# EAGLE design untitled (EAGLE 9.5.1)
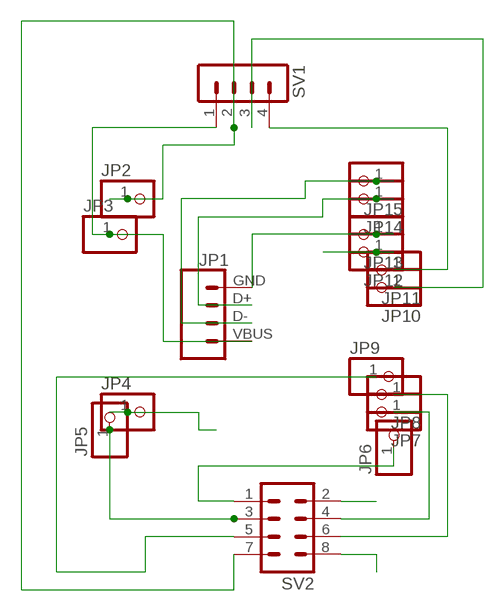
[diagram p0: schematic, sheet 1]

## Parts
JP1  USB_SOLDER_PADS  [USB-SOLDER-PADS]
JP2  PINHD-1X1  [1X01]
JP3  PINHD-1X1  [1X01]
JP4  PINHD-1X1  [1X01]
JP5  PINHD-1X1  [1X01]
JP6  PINHD-1X1  [1X01]
JP7  PINHD-1X1  [1X01]
JP8  PINHD-1X1  [1X01]
JP9  PINHD-1X1  [1X01]
JP10  PINHD-1X1  [1X01]
JP11  PINHD-1X1  [1X01]
JP12  PINHD-1X1  [1X01]
JP13  PINHD-1X1  [1X01]
JP14  PINHD-1X1  [1X01]
JP15  PINHD-1X1  [1X01]
SV1  MA04-1  [MA04-1]
SV2  MA04-2  [MA04-2]

## Nets
N$1: JP1.VBUS JP3.1 SV1.1
N$2: JP1.GND JP13.1
N$3: JP11.1 SV1.4
N$4: JP10.1 SV1.3
N$5: JP8.1 SV2.6
N$6: JP1.D+ JP14.1
N$7: JP1.D- JP15.1
N$8: JP12.1
N$9: JP5.1 SV2.3
N$10: JP6.1 SV2.1
N$11: JP4.1
N$12: JP7.1 SV2.4
N$13: SV2.8
N$14: SV2.2
N$16: JP2.1 SV1.2 SV2.7
N$18: JP9.1 SV2.5

## Library data of the parts
JP1 = SparkFun-Connectors:USB_SOLDER_PADS: Solder pad access to USB pins. Helpful to expose on PCBs so user can attach external USB connector if necessary.
JP2-JP15 = pinhead:PINHD-1X1: PIN HEADER
SV1 = con-lstb:MA04-1: PIN HEADER; OC_FARNELL: unknown; OC_NEWARK: unknown
SV2 = con-lstb:MA04-2: PIN HEADER; OC_FARNELL: unknown; OC_NEWARK: unknown

## Board
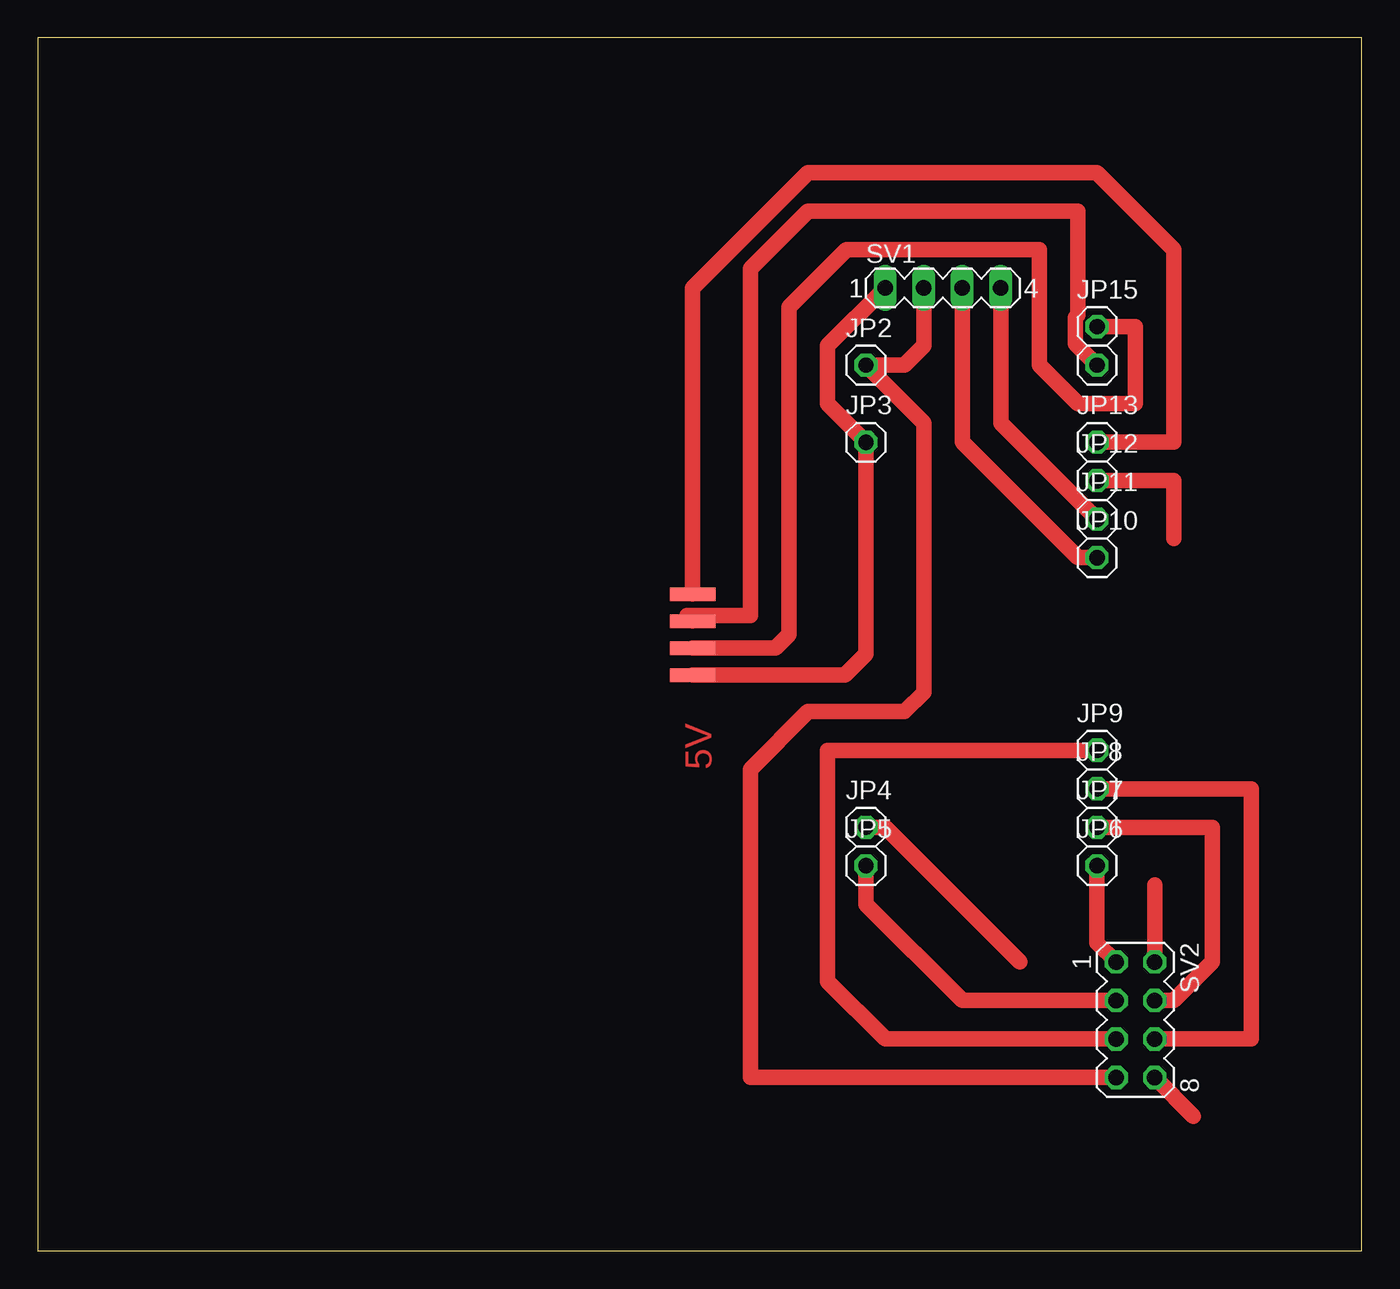
[diagram p1: board, top side]

Size 87.3 x 80 mm. Coordinates in mm from the lower left corner, seen from the top.
Outline: 0,0 87.3,0 87.3,80 0,80 0,0
Copper layers (1*16): Top 0.035mm / dielectric 1.5mm / Bottom 0.035mm
Design rules "default": minimum track width 10mil, minimum drill 0.35mm, track to track 10mil, track to pad 6mil, pad to pad 6mil, via to via 6mil, smd to smd 6mil, copper to edge 40mil, drill to drill 6mil, minimum pad ring 10mil, minimum via ring 8mil, stop-mask expansion 4mil, vias tented up to drill 0mil, thermal gap 10mil

### Footprints (pad centres in the part's own frame; a part is rotated, then mirrored left to right if it is on the bottom)
USB-SOLDER-PADS = smd 3 x 0.9: D+ 0,-0.889; D- 0,0.889; GND 0,-2.667; VBUS 0,2.667
1X01 = drill 1.016 octagon: 1 0,0
MA04-1 = drill 1.016 long: 1 -3.81,0; 2 -1.27,0; 3 1.27,0; 4 3.81,0
MA04-2 = drill 1.016 octagon: 1 -3.81,-1.27; 2 -3.81,1.27; 3 -1.27,-1.27; 4 -1.27,1.27; 5 1.27,-1.27; 6 1.27,1.27; 7 3.81,-1.27; 8 3.81,1.27

### Placement (x,y rotation side)
JP1  43.18,40.64 180 top
JP2  54.61,58.42 0 top
JP3  54.61,53.34 0 top
JP4  54.61,27.94 0 top
JP5  54.61,25.4 0 top
JP6  69.85,25.4 0 top
JP7  69.85,27.94 0 top
JP8  69.85,30.48 0 top
JP9  69.85,33.02 0 top
JP10  69.85,45.72 0 top
JP11  69.85,48.26 0 top
JP12  69.85,50.8 0 top
JP13  69.85,53.34 0 top
JP14  69.85,58.42 0 top
JP15  69.85,60.96 0 top
SV1  59.69,63.5 0 top
SV2  72.39,15.24 270 top

### Tracks (layer width: path | path; a pad name or v marks a point on that pad's centre or on a via)
N$1
  Top 1.016: SV1.1 52.07,59.69 52.07,55.88 JP3.1 54.61,39.37 53.21,37.97 JP1.VBUS
N$2
  Top 1.016: JP13.1 74.93,53.34 74.93,66.04 69.85,71.12 50.8,71.12 43.18,63.5 JP1.GND
N$3
  Top 1.016: JP11.1 63.5,54.61 SV1.4
N$4
  Top 1.016: JP10.1 68.58,45.72 60.96,53.34 SV1.3
N$5
  Top 1.016: JP8.1 80.01,30.48 80.01,13.97 SV2.6
N$6
  Top 1.016: JP14.1 68.43,59.84 68.43,61.55 68.58,61.7 68.58,68.58 50.8,68.58 46.99,64.77 46.99,41.91 44.07,41.91 43.18,41.91 42.8,41.91 JP1.D+
N$7
  Top 1.016: JP15.1 72.39,60.96 72.39,55.88 68.58,55.88 66.04,58.42 66.04,66.04 53.34,66.04 49.53,62.23 49.53,40.64 48.64,39.75 JP1.D-
N$8
  Top 1.016: JP12.1 72.39,50.8 73.66,50.8 74.93,50.8 74.93,46.99
N$9
  Top 1.016: JP5.1 54.61,22.86 60.96,16.51 SV2.3
N$10
  Top 1.016: SV2.1 69.85,20.32 JP6.1
N$11
  Top 1.016: JP4.1 55.88,27.94 64.77,19.05
N$12
  Top 1.016: SV2.4 74.93,16.51 77.47,19.05 77.47,27.94 JP7.1
N$13
  Top 1.016: SV2.8 76.2,8.89
N$14
  Top 1.016: SV2.2 73.66,22.86 73.66,24.13
N$16
  Top 1.016: SV1.2 58.42,59.69 57.15,58.42 JP2.1 58.42,54.61 58.42,36.83 57.15,35.56 50.8,35.56 46.99,31.75 46.99,11.43 SV2.7
N$18
  Top 1.016: JP9.1 52.07,33.02 52.07,17.78 55.88,13.97 SV2.5

### Text on the board
Top: 5V